# Altium schematic sheet Power Management.SchDoc
size A4; Author: İlker KESER; Revision: V1.0; SheetNumber: 3; SheetTotal: 9; Page: 3; Project Code: 02050838; Template: A4; Page Total: 9
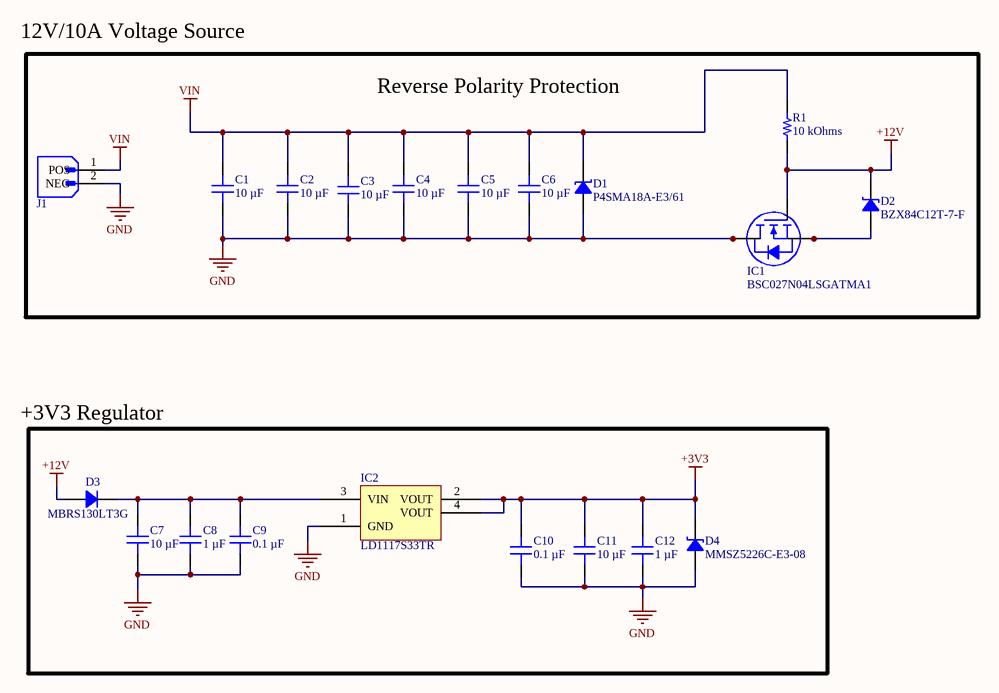
[diagram p0: Power Management.SchDoc]

## Parts
C1  10 µF  [MURATA CAP GRM31M 1206_3216]
C2  10 µF  [MURATA CAP GRM31M 1206_3216]
C3  10 µF  [MURATA CAP GRM31M 1206_3216]
C4  10 µF  [MURATA CAP GRM31M 1206_3216]
C5  10 µF  [MURATA CAP GRM31M 1206_3216]
C6  10 µF  [MURATA CAP GRM31M 1206_3216]
C7  10 µF  [CAP 0603_1608]
C8  1 µF  [MURATA GCM188 0603_1608]
C9  0.1 µF  [CAP 0603_1608]
C10  0.1 µF  [CAP 0603_1608]
C11  10 µF  [CAP 0603_1608]
C12  1 µF  [MURATA GCM188 0603_1608]
D1  P4SMA18A-E3/61  [DO214AC SMA]
D2  BZX84C12T-7-F  [DIODES SOT-523]
D3  MBRS130LT3G  [DO214AA SMB]
D4  MMSZ5226C-E3-08  [SOD-123]
IC1  BSC027N04LSGATMA1  [INFINEON PG-TDSON-8 6.15X5.32MM]
IC2  LD1117S33TR  [ST SOT-223]
J1  XT90 Connector  [XT90 Conn]  (value not drawn)
R1  10 kOhms  [YAGEO RES 0603_1608]

## Blocks framed on the sheet
Reverse Polarity Protection: C1-C6 D1 D2 IC1 J1 R1

## Nets
+3V3: C10.2 C11.2 C12.2 D4.2 IC2.2(VOUT) IC2.4(VOUT)
+12V: D2.2 D3.1 IC1.4(G) R1.1
GND: C1.1 C2.1 C3.1 C4.1 C5.1 C6.1 C7.1 C8.1 C9.1 C10.1 C11.1 C12.1 D1.1 D4.1 IC1.5(D) IC1.6(D) IC1.7(D) IC1.8(D) IC2.1(GND) J1.2(NEG)
VIN: C1.2 C2.2 C3.2 C4.2 C5.2 C6.2 D1.2 J1.1(POS) R1.2
NetC7_2: C7.2 C8.2 C9.2 D3.2 IC2.3(VIN)
NetD2_1: D2.1 IC1.1(S) IC1.2(S) IC1.3(S)

## Notes on the sheet
- 12V/10A Voltage Source
- +3V3 Regulator
- TITLE:
- DOCUMENT NAME:
- PROJECT CODE:
- TEMPLATE:
- REVISION:
- Sheet:
- of
- AUTHOR:

## Library data of the parts
C1-C6 = GRM319R61E106MA12D: CAP CER 10UF 25V X5R 1206; manufacturer: Murata Electronics; Tolerance: ±20%; Part Number: GRM319R61E106MA12D; Capacitance: 10 µF; Applications: General Purpose; componentlink1description: Datasheet; componentlink1url: https://search.murata.co.jp/Ceramy/image/img/A01X/G101/ENG/GRM319R61E106MA12-01A.pdf; componentlink2description: DigiKey Link; componentlink2url: https://www.digikey.com/en/products/detail/murata-electronics/GRM319R61E106MA12D/8323880; Device Package: 1206 (3216 Metric); lastupdated: 25.07.2024 10:41:13; Lifecycle Status: Active; Minimum Order: 1; Mounting Type: Surface Mount, MLCC; Operating Temperature: -55°C ~ 85°C; Package / Case: 1206 (3216 Metric); packaging: TapeAndReel; partid: 59156; price: 0.05; series: GRM; Size / Dimension: 0.126" L x 0.063" W (3.20mm x 1.60mm); Supplier 1: DigiKey; Supplier Part Number 1: 490-GRM319R61E106MA12DCT-ND; Temperature Coefficient: X5R; Thickness (Max): 0.037" (0.95mm); value: 10 µF; Voltage - Rated: 25V
C7 C11 = CC0603MRX5R7BB106: CAP CER 10UF 16V X5R 0603; manufacturer: Yageo; Tolerance: ±20%; Part Number: CC0603MRX5R7BB106; Capacitance: 10 µF; Applications: General Purpose; componentlink1description: Datasheet; componentlink1url: https://www.yageo.com/upload/media/product/productsearch/datasheet/mlcc/UPY-GPHC_X5R_4V-to-50V_26.pdf; componentlink2description: DigiKey Link; componentlink2url: https://www.digikey.com/en/products/detail/yageo/CC0603MRX5R7BB106/5195229; Device Package: 0603 (1608 Metric); lastupdated: 9.02.2024 20:09:51; Lifecycle Status: Active; Minimum Order: 1; Mounting Type: Surface Mount, MLCC; Operating Temperature: -55°C ~ 85°C; Package / Case: 0603 (1608 Metric); packaging: TapeAndReel; partid: 41163; Part Status: Active; price: 0.08; series: CC; Size / Dimension: 0.063" L x 0.031" W (1.60mm x 0.80mm); Supplier 1: DigiKey; Supplier Part Number 1: 311-1822-1-ND; Temperature Coefficient: X5R; Thickness (Max): 0.035" (0.90mm); value: 10 µF; Voltage - Rated: 16V
C8 C12 = GCM188R71C105KA64J: CAP CER 1UF 16V X7R 0603; manufacturer: Murata Electronics; Tolerance: ±10%; Part Number: GCM188R71C105KA64J; Capacitance: 1 µF; Applications: Automotive; componentlink1description: Datasheet; componentlink1url: https://www.murata.com/~/media/webrenewal/support/library/catalog/products/capacitor/mlcc/c03e.ashx?la=en-us; componentlink2description: DigiKey Link; componentlink2url: https://www.digikey.com/en/products/detail/murata-electronics/GCM188R71C105KA64J/4903955; Device Package: 0603 (1608 Metric); lastupdated: 20.07.2024 00:25:01; Lifecycle Status: Active; Minimum Order: 1; Mounting Type: Surface Mount, MLCC; Operating Temperature: -55°C ~ 125°C; Package / Case: 0603 (1608 Metric); packaging: TapeAndReel; partid: 13992; Part Status: Active; price: 0.02; Ratings: AEC-Q200; series: GCM; Size / Dimension: 0.063" L x 0.031" W (1.60mm x 0.80mm); Supplier 1: DigiKey; Supplier Part Number 1: 490-12657-1-ND; Temperature Coefficient: X7R; Thickness (Max): 0.035" (0.90mm); value: 1 µF; Voltage - Rated: 16V
C9 C10 = C0603X104M3RAC7867: CAP CER 0.1UF 25V X7R 0603; manufacturer: KEMET; Tolerance: ±20%; Part Number: C0603X104M3RAC7867; Capacitance: 0.1 µF; Applications: Boardflex Sensitive; componentlink1description: Datasheet; componentlink1url: https://api.kemet.com/component-edge/download/datasheet/C0603X104M3RACTU.pdf; componentlink2description: DigiKey Link; componentlink2url: https://www.digikey.com/en/products/detail/kemet/C0603X104M3RAC7867/2202613; Device Package: 0603 (1608 Metric); Features: Soft Termination; lastupdated: 9.02.2024 20:10:30; Lifecycle Status: Active; Minimum Order: 1; Mounting Type: Surface Mount, MLCC; Operating Temperature: -55°C ~ 125°C; Package / Case: 0603 (1608 Metric); packaging: TapeAndReel; partid: 2484; Part Status: Active; price: 0.06; series: SMD Comm X7R Flex; Size / Dimension: 0.063" L x 0.031" W (1.60mm x 0.80mm); Supplier 1: DigiKey; Supplier Part Number 1: 399-13148-1-ND; Temperature Coefficient: X7R; Thickness (Max): 0.034" (0.87mm); value: 0.1 µF; Voltage - Rated: 25V
D1 = P4SMA18A-E3/61: TVS DIODE 15.3V 25.2V DO214AC; Manufacturer: Vishay Semiconductor Diodes Division; Current - Peak Pulse (10/1000µs): 15.9A; Power Line Protection: No; Power - Peak Pulse: 400W; Type: Zener; Unidirectional Channels: 1; Voltage - Breakdown (Min): 17.1V; Part Number: P4SMA18A-E3/61; Applications: General Purpose; ComponentLink1Description: Datasheet; ComponentLink1URL: http://www.vishay.com/docs/88367/p4sma.pdf; ComponentLink2Description: DigiKey Link; ComponentLink2URL: http://digikey.com/product-detail/en/vishay-semiconductor-diodes-division/P4SMA18A-E3-61/P4SMA18A-E3-61GICT-ND/5639034; LastUpdated: 3.06.2024 19:57:21; Lifecycle Status: Active; Minimum Order: 1; Mounting Type: Surface Mount; Operating Temperature: -65°C ~ 150°C (TJ); Package / Case: DO-214AC, SMA; Packaging: TapeAndReel; PartId: 5591; Part Status: Active; Price: 0.10; Series: P4SMA, TransZorb®; Supplier 1: DigiKey; Supplier Part Number 1: P4SMA18A-E3/61GICT-ND; Supplier Device Package: DO-214AC (SMA); Voltage - Clamping (Max) @ Ipp: 25.2V; Voltage - Reverse Standoff (Typ): 15.3V
D2 = BZX84C12T-7-F: DIODE ZENER 12V 150MW SOT523; Manufacturer: Diodes Incorporated; Current - Reverse Leakage @ Vr: 100 nA @ 8 V; Impedance (Max) (Zzt): 25 Ohms; Tolerance: ±5%; Voltage - Forward (Vf) (Max) @ If: 900 mV @ 10 mA; Part Number: BZX84C12T-7-F; ComponentLink1Description: Datasheet; ComponentLink1URL: https://www.diodes.com/assets/Datasheets/ds30262.pdf; ComponentLink2Description: DigiKey Link; ComponentLink2URL: https://www.digikey.com/en/products/detail/diodes-incorporated/BZX84C12T-7-F/1934510; LastUpdated: 3.06.2024 20:01:51; Lifecycle Status: Active; Minimum Order: 1; Mounting Type: Surface Mount; Operating Temperature: -65°C ~ 150°C; Package / Case: SOT-523; Packaging: TapeAndReel; PartId: 779; Part Status: Active; Power - Max: 150 mW; Price: 0.04; Series: -; Supplier 1: DigiKey; Supplier Part Number 1: BZX84C12T-7-FDICT-ND; Supplier Device Package: SOT-523; Voltage - Zener (Nom) (Vz): 12 V
D3 = MBRS130LT3G: DIODE SCHOTTKY 30V 2A SMB; Manufacturer: ON Semiconductor; Current - Reverse Leakage @ Vr: 1mA @ 30V; Speed: Fast Recovery =< 500ns, > 200mA (Io); Voltage - Forward (Vf) (Max) @ If: 445mV @ 2A; Part Number: MBRS130LT3G; ComponentLink1Description: Datasheet; ComponentLink1URL: https://www.onsemi.com/pub/Collateral/MBRS130LT3-D.PDF; ComponentLink2Description: DigiKey Link; ComponentLink2URL: http://digikey.com/product-detail/en/on-semiconductor/MBRS130LT3G/MBRS130LT3GOSCT-ND/918000; Current - Average Rectified (Io): 2A; Diode Type: Schottky; LastUpdated: 3.06.2024 19:54:02; Lifecycle Status: Active; Minimum Order: 1; Mounting Type: Surface Mount; Operating Temperature - Junction: -65°C ~ 125°C; Package / Case: DO-214AA, SMB; Packaging: TapeAndReel; PartId: 1388; Part Status: Active; Price: 0.09; Series: -; Supplier 1: DigiKey; Supplier Part Number 1: MBRS130LT3GOSCT-ND; Supplier Device Package: SMB; Voltage - DC Reverse (Vr) (Max): 30V
D4 = MMSZ5226C-E3-08: DIODE ZENER 3.3V 500MW SOD123; Manufacturer: Vishay Semiconductor Diodes Division; Current - Reverse Leakage @ Vr: 25µA @ 1V; Impedance (Max) (Zzt): 28 Ohms; Tolerance: ±2%; Part Number: MMSZ5226C-E3-08; ComponentLink1Description: Datasheet; ComponentLink1URL: http://www.vishay.com/docs/85774/mmsz5225.pdf; ComponentLink2Description: DigiKey Link; ComponentLink2URL: http://digikey.com/product-detail/en/vishay-semiconductor-diodes-division/MMSZ5226C-E3-08/MMSZ5226C-E3-08GICT-ND/7717476; LastUpdated: 3.06.2024 19:55:49; Lifecycle Status: Active; Minimum Order: 1; Mounting Type: Surface Mount; Operating Temperature: -55°C ~ 150°C; Package / Case: SOD-123; Packaging: TapeAndReel; PartId: 1697; Part Status: Active; Power - Max: 500mW; Price: 0.06; Series: Automotive, AEC-Q101; Supplier 1: DigiKey; Supplier Part Number 1: MMSZ5226C-E3-08GICT-ND; Supplier Device Package: SOD-123; Voltage - Zener (Nom) (Vz): 3.3V
IC1 = BSC027N04LSGATMA1: MOSFET N-CH 40V 24A/100A TDSON; Manufacturer: Infineon Technologies; Current - Continuous Drain (Id) @ 25°C: 24A (Ta), 100A (Tc); Drive Voltage (Max Rds On,  Min Rds On): 4.5V, 10V; FET Type: N-Channel; Gate Charge (Qg) (Max) @ Vgs: 85 nC @ 10 V; Input Capacitance (Ciss) (Max) @ Vds: 6800 pF @ 20 V; Power Dissipation (Max): 2.5W (Ta), 83W (Tc); Rds On (Max) @ Id, Vgs: 2.7mOhm @ 50A, 10V; Vgs (Max): ±20V; Vgs(th) (Max) @ Id: 2V @ 49µA; Part Number: BSC027N04LSGATMA1; ComponentLink1Description: Datasheet; ComponentLink1URL: https://www.infineon.com/dgdl/BSC027N04LSG_rev1.04.pdf?folderId=db3a3043156fd5730115c7d50620107c&fileId=db3a30431689f4420116c4323646080c; ComponentLink2Description: DigiKey Link; ComponentLink2URL: https://www.digikey.com/en/products/detail/infineon-technologies/BSC027N04LSGATMA1/2080616; Drain to Source Voltage (Vdss): 40 V; LastUpdated: 3.06.2024 20:19:55; Lifecycle Status: Active; Minimum Order: 1; Mounting Type: Surface Mount; Operating Temperature: -55°C ~ 150°C (TJ); Package / Case: 8-PowerTDFN; Packaging: TapeAndReel; Part Status: Active; Price: 0.57; Series: OptiMOS™; Supplier 1: DigiKey; Supplier Part Number 1: BSC027N04LSGATMA1CT-ND; Supplier Device Package: PG-TDSON-8-1; Technology: MOSFET (Metal Oxide)
IC2 = LD1117S33TR: IC REG LINEAR 3.3V 800MA SOT223; Manufacturer: STMicroelectronics; Current - Quiescent (Iq): 10 mA; Number of Regulators: 1; Output Configuration: Positive; Output Type: Fixed; Protection Features: Over Current, Over Temperature; PSRR: 75dB (120Hz); Voltage Dropout (Max): 1.2V @ 800mA; Voltage - Input (Max): 15V; Part Number: LD1117S33TR; ComponentLink1Description: Datasheet; ComponentLink1URL: http://www.st.com/content/ccc/resource/technical/document/datasheet/99/3b/7d/91/91/51/4b/be/CD00000544.pdf/files/CD00000544.pdf/jcr:content/translations/en.CD00000544.pdf; ComponentLink2Description: DigiKey Link; ComponentLink2URL: https://www.digikey.com/en/products/detail/stmicroelectronics/LD1117S33TR/585766; Current - Output: 800mA; LastUpdated: 3.06.2024 20:14:20; Lifecycle Status: Active; Minimum Order: 1; Mounting Type: Surface Mount; Operating Temperature: 0°C ~ 125°C; Package / Case: TO-261-4, TO-261AA; Packaging: TapeAndReel; Part Status: Active; Price: 0.13; Series: -; Supplier 1: DigiKey; Supplier Part Number 1: 497-1242-1-ND; Supplier Device Package: SOT-223; Voltage - Output (Min/Fixed): 3.3V
J1 = XT90 Connector: Li-Po battery connector
R1 = AA0603FR-0710KL: RES SMD 10K OHM 1% 1/10W 0603; Manufacturer: Yageo; Power (Watts): 0.1W, 1/10W; Temperature Coefficient: ±150ppm/°C; Part Number: AA0603FR-0710KL; Value: 10 kOhms; ComponentLink1Description: Datasheet; ComponentLink1URL: https://www.yageo.com/upload/media/product/productsearch/datasheet/rchip/PYu-AA_51_RoHS_L_3.pdf; ComponentLink2Description: DigiKey Link; ComponentLink2URL: https://www.digikey.com/en/products/detail/yageo/AA0603FR-0710KL/5888698; Composition: Thick Film; Device Package: 0603 (1608 Metric); Features: Anti-Sulfur, Automotive AEC-Q200, Moisture Resistant; Height - Seated (Max): 0.022" (0.55mm); LastUpdated: 25.07.2024 09:19:15; Lifecycle Status: Active; Minimum Order: 1; Number of Terminations: 2; Operating Temperature: -55°C ~ 155°C; Package / Case: 0603 (1608 Metric); Packaging: TapeAndReel; PartId: 64302; Part Status: Active; Price: 0.01; Ratings: AEC-Q200; Resistance: 10 kOhms; Series: AA; Size / Dimension: 0.063" L x 0.031" W (1.60mm x 0.80mm); Supplier 1: DigiKey; Supplier Part Number 1: 13-AA0603FR-0710KLCT-ND; Supplier Device Package: 0603; Tolerance: ±1%